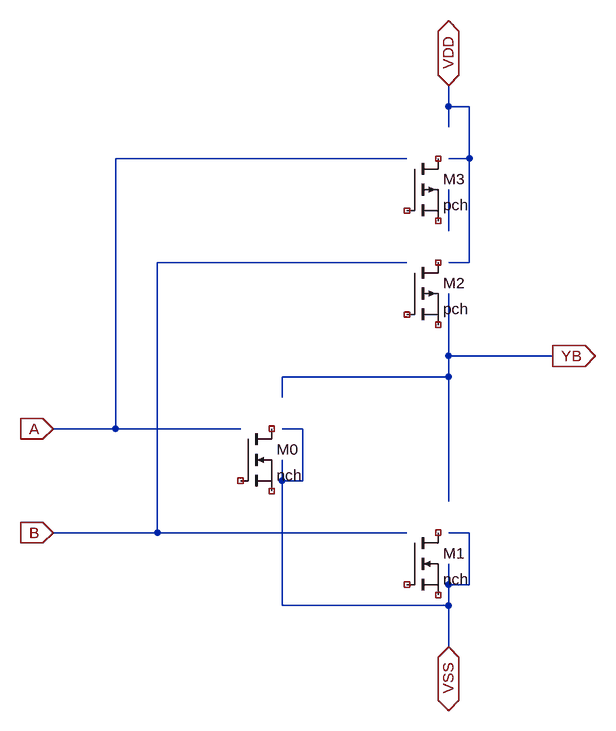
[diagram p0: schematic nr21.asc]
nr21.asc, the LTspice schematic file:
Version 4
SHEET 1 944 1056
WIRE 448 704 480 704
WIRE 448 704 448 672
WIRE 480 704 480 624
WIRE 448 624 480 624
WIRE 704 784 736 784
WIRE 736 864 736 784
WIRE 704 864 736 864
WIRE 704 864 704 832
WIRE 448 896 704 896
WIRE 704 896 704 864
WIRE 448 896 448 704
WIRE 704 960 704 896
WIRE 704 208 736 208
WIRE 736 208 736 128
WIRE 704 128 736 128
WIRE 704 128 704 96
WIRE 736 368 736 208
WIRE 704 368 736 368
WIRE 704 160 704 128
WIRE 704 320 704 256
WIRE 704 512 864 512
WIRE 704 512 704 416
WIRE 704 544 704 512
WIRE 704 736 704 544
WIRE 448 544 704 544
WIRE 448 576 448 544
WIRE 256 368 640 368
WIRE 256 784 256 368
WIRE 256 784 640 784
WIRE 96 784 256 784
WIRE 192 208 640 208
WIRE 192 624 192 208
WIRE 192 624 384 624
WIRE 96 624 192 624
SYMBOL PMOS 640 208 R0
SYMATTR InstName M3
SYMATTR Value pch
SYMATTR Value2 w=6u l=1u
SYMBOL PMOS 640 368 R0
SYMATTR InstName M2
SYMATTR Value pch
SYMATTR Value2 w=6u l=1u
SYMBOL NMOS 640 784 R0
SYMATTR InstName M1
SYMATTR Value nch
SYMATTR Value2 w=2u l=1u
SYMBOL NMOS 384 624 R0
SYMATTR InstName M0
SYMATTR Value nch
SYMATTR Value2 w=2u l=1u
FLAG 864 512 YB
IOPIN 864 512 Out
FLAG 704 960 VSS
IOPIN 704 960 BiDir
FLAG 704 96 VDD
IOPIN 704 96 BiDir
FLAG 96 784 B
IOPIN 96 784 In
FLAG 96 624 A
IOPIN 96 624 In

The netlist it stands for:
* nr21.asc
* M3: pch w=6u l=1u (symbol PMOS not certain, pin order unknown); nets seen at it: 
* M2: pch w=6u l=1u (symbol PMOS not certain, pin order unknown); nets seen at it: 
* M1: nch w=2u l=1u (symbol NMOS not certain, pin order unknown); nets seen at it: 
* M0: nch w=2u l=1u (symbol NMOS not certain, pin order unknown); nets seen at it: 
.backanno
.end